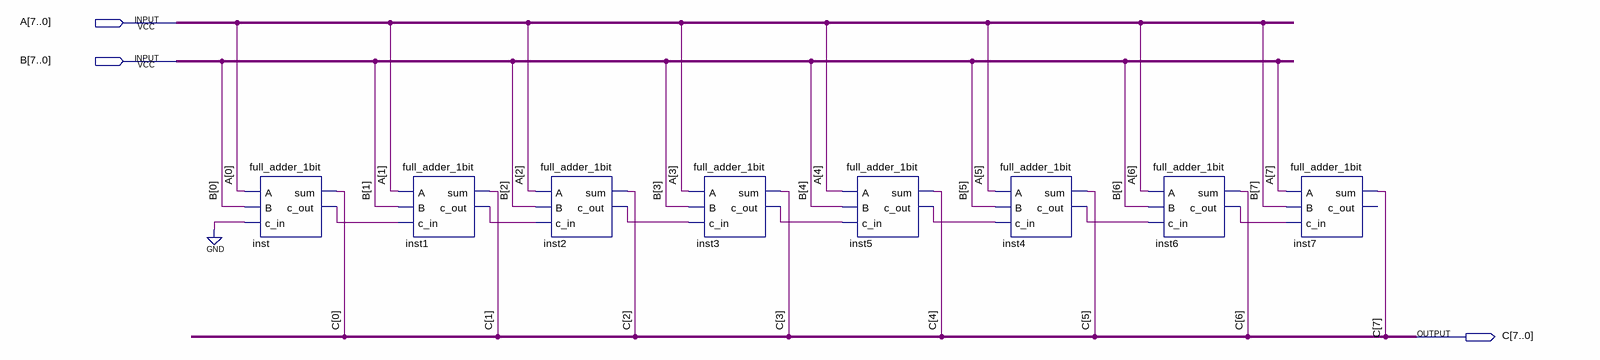
[diagram p0: schematic sheet]
// Quartus schematic full_adder_8bit.bdf as structural Verilog: 8 symbols, 3 pins
module full_adder_8bit (
  input  [7:0] A,
  input  [7:0] B,
  output [7:0] C
);

  wire inst1_c_out, inst2_c_out, inst3_c_out, inst4_c_out, inst5_c_out, inst6_c_out, inst_c_out;

  full_adder_1bit inst (.A(A[0]), .B(B[0]), .c_in(1'b0), .sum(C[0]), .c_out(inst_c_out));
  full_adder_1bit inst1 (.A(A[1]), .B(B[1]), .c_in(inst_c_out), .sum(C[1]), .c_out(inst1_c_out));
  full_adder_1bit inst2 (.A(A[2]), .B(B[2]), .c_in(inst1_c_out), .sum(C[2]), .c_out(inst2_c_out));
  full_adder_1bit inst3 (.A(A[3]), .B(B[3]), .c_in(inst2_c_out), .sum(C[3]), .c_out(inst3_c_out));
  full_adder_1bit inst5 (.A(A[4]), .B(B[4]), .c_in(inst3_c_out), .sum(C[4]), .c_out(inst5_c_out));
  full_adder_1bit inst4 (.A(A[5]), .B(B[5]), .c_in(inst5_c_out), .sum(C[5]), .c_out(inst4_c_out));
  full_adder_1bit inst6 (.A(A[6]), .B(B[6]), .c_in(inst4_c_out), .sum(C[6]), .c_out(inst6_c_out));
  full_adder_1bit inst7 (.A(A[7]), .B(B[7]), .c_in(inst6_c_out), .sum(C[7]));  // open: c_out
endmodule
